# Altium project ArtixDuo.PrjPcb (part 1 of 8)
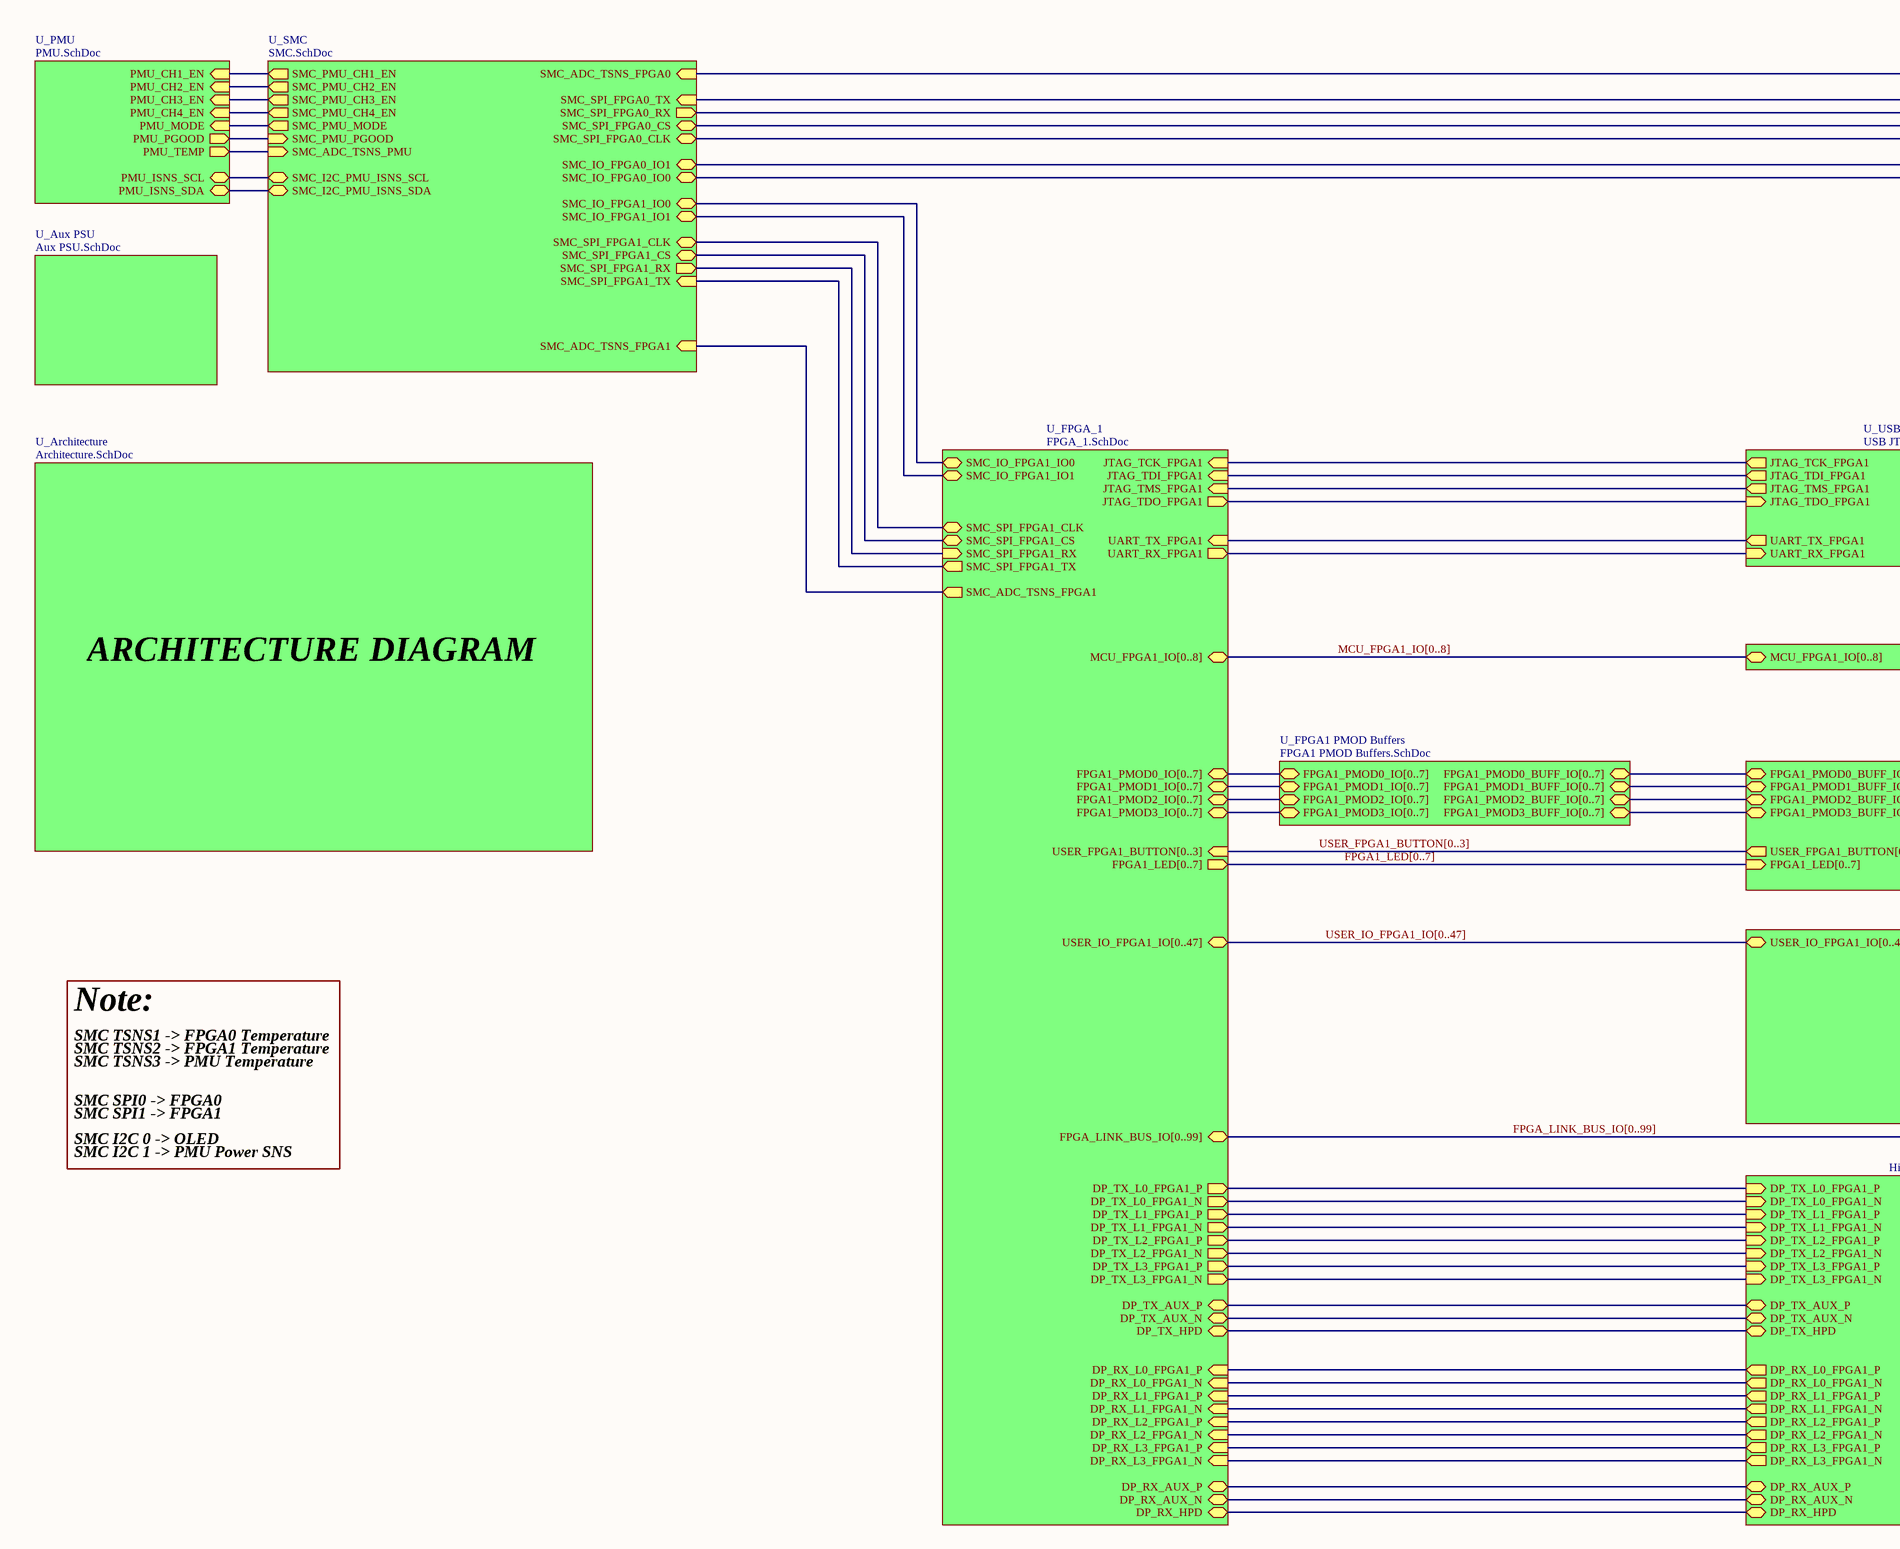
[diagram p0: Top.SchDoc, top left]
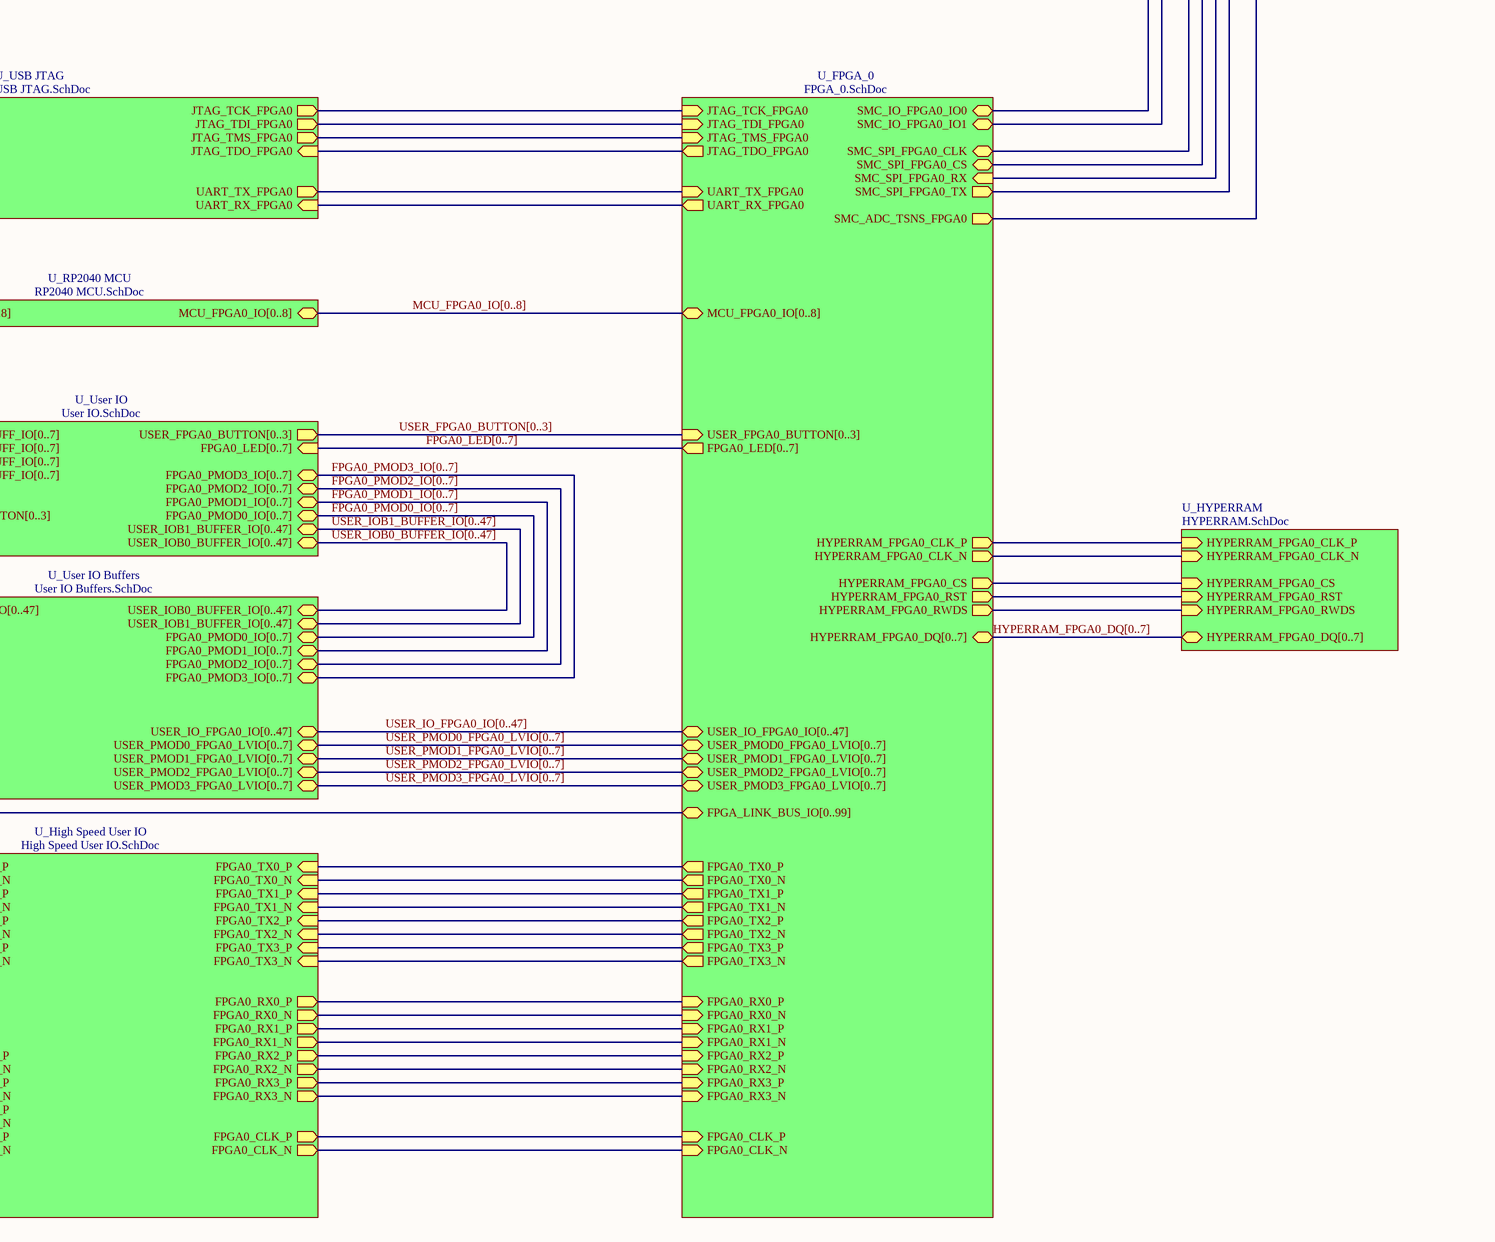
[diagram p1: Top.SchDoc, top right]
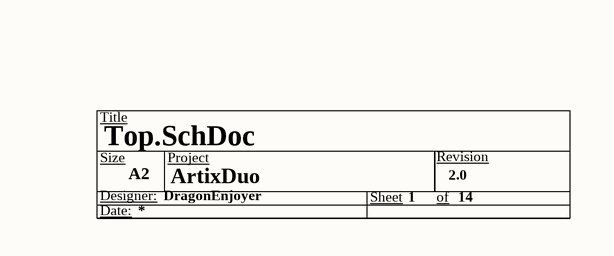
[diagram p2: Top.SchDoc, bottom right]
DesignedByURL: DragonEnjoyer; Project: ArtixDuo; VersionRevision: 2.0
14 sheets, 905 parts. Net scope: hierarchical (ports join the sheet entries above them; power ports are global).
Board file: PCB1.PcbDoc
Sheets:
  Top.SchDoc
    U_Aux PSU = Aux PSU.SchDoc
    U_FPGA_0 = FPGA_0.SchDoc
    U_FPGA_1 = FPGA_1.SchDoc
    U_PMU = PMU.SchDoc
    U_RP2040 MCU = RP2040 MCU.SchDoc
    U_SMC = SMC.SchDoc
    U_USB JTAG = USB JTAG.SchDoc
    U_User IO = User IO.SchDoc
    U_High Speed User IO = High Speed User IO.SchDoc
    U_User IO Buffers = User IO Buffers.SchDoc
    U_HYPERRAM = HYPERRAM.SchDoc
    U_Architecture = Architecture.SchDoc
    U_FPGA1 PMOD Buffers = FPGA1 PMOD Buffers.SchDoc

## Sheet Top.SchDoc
size A1; SheetNumber: 1; SheetTotal: 14

### Parts
(Parts that share a designator on the sheet are numbered #1, #2 ... from top to bottom, then left to right.)
*#1  Size: A2  (hidden comment: Title Block)  (graphical)

### Sub-sheets
U_Architecture = Architecture.SchDoc: no entries
U_Aux PSU = Aux PSU.SchDoc: no entries
U_FPGA1 PMOD Buffers = FPGA1 PMOD Buffers.SchDoc: FPGA1_PMOD0_IO[0..7] (bidir), FPGA1_PMOD1_IO[0..7] (bidir), FPGA1_PMOD2_IO[0..7] (bidir), FPGA1_PMOD3_IO[0..7] (bidir), FPGA1_PMOD1_BUFF_IO[0..7] (bidir), FPGA1_PMOD2_BUFF_IO[0..7] (bidir), FPGA1_PMOD3_BUFF_IO[0..7] (bidir), FPGA1_PMOD0_BUFF_IO[0..7] (bidir)
U_FPGA_0 = FPGA_0.SchDoc: JTAG_TDO_FPGA0 (out), UART_TX_FPGA0 (in), UART_RX_FPGA0 (out), JTAG_TCK_FPGA0 (in), JTAG_TDI_FPGA0 (in), JTAG_TMS_FPGA0 (in), SMC_IO_FPGA0_IO0 (bidir), SMC_IO_FPGA0_IO1 (bidir), MCU_FPGA0_IO[0..8] (bidir), SMC_SPI_FPGA0_RX (in), SMC_SPI_FPGA0_CS (bidir), SMC_SPI_FPGA0_CLK (bidir), SMC_SPI_FPGA0_TX (out), USER_FPGA0_BUTTON[0..3] (in), FPGA0_LED[0..7] (out), FPGA_LINK_BUS_IO[0..99] (bidir), USER_IO_FPGA0_IO[0..47] (bidir), FPGA0_TX0_P (out), FPGA0_TX0_N (out), FPGA0_TX1_P (out), FPGA0_TX1_N (out), FPGA0_TX2_P (out), FPGA0_TX2_N (out), FPGA0_TX3_P (out), FPGA0_TX3_N (out), FPGA0_RX0_P (in), FPGA0_RX0_N (in), FPGA0_RX1_P (in), FPGA0_RX1_N (in), FPGA0_RX2_P (in), FPGA0_RX2_N (in), FPGA0_RX3_P (in), FPGA0_RX3_N (in), FPGA0_CLK_N (in), FPGA0_CLK_P (in), HYPERRAM_FPGA0_CS (out), HYPERRAM_FPGA0_RWDS (out), HYPERRAM_FPGA0_DQ[0..7] (bidir), HYPERRAM_FPGA0_RST (out), USER_PMOD0_FPGA0_LVIO[0..7] (bidir), USER_PMOD1_FPGA0_LVIO[0..7] (bidir), USER_PMOD2_FPGA0_LVIO[0..7] (bidir), USER_PMOD3_FPGA0_LVIO[0..7] (bidir), HYPERRAM_FPGA0_CLK_P (out), HYPERRAM_FPGA0_CLK_N (out), SMC_ADC_TSNS_FPGA0 (out)
U_FPGA_1 = FPGA_1.SchDoc: JTAG_TDO_FPGA1 (out), UART_TX_FPGA1 (in), UART_RX_FPGA1 (out), JTAG_TCK_FPGA1 (in), JTAG_TDI_FPGA1 (in), JTAG_TMS_FPGA1 (in), DP_RX_L3_FPGA1_P (in), DP_RX_L3_FPGA1_N (in), DP_RX_L2_FPGA1_P (in), DP_RX_L2_FPGA1_N (in), DP_RX_L1_FPGA1_P (in), DP_RX_L1_FPGA1_N (in), DP_RX_L0_FPGA1_P (in), DP_RX_L0_FPGA1_N (in), DP_RX_AUX_P (bidir), DP_RX_AUX_N (bidir), DP_RX_HPD (bidir), DP_TX_L3_FPGA1_P (out), DP_TX_L3_FPGA1_N (out), DP_TX_L2_FPGA1_P (out), DP_TX_L2_FPGA1_N (out), DP_TX_L1_FPGA1_P (out), DP_TX_L1_FPGA1_N (out), DP_TX_L0_FPGA1_P (out), DP_TX_L0_FPGA1_N (out), DP_TX_AUX_P (bidir), DP_TX_AUX_N (bidir), DP_TX_HPD (bidir), SMC_IO_FPGA1_IO0 (bidir), SMC_IO_FPGA1_IO1 (bidir), MCU_FPGA1_IO[0..8] (bidir), SMC_SPI_FPGA1_RX (in), SMC_SPI_FPGA1_CS (bidir), SMC_SPI_FPGA1_CLK (bidir), SMC_SPI_FPGA1_TX (out), USER_FPGA1_BUTTON[0..3] (in), FPGA1_LED[0..7] (out), FPGA_LINK_BUS_IO[0..99] (bidir), USER_IO_FPGA1_IO[0..47] (bidir), FPGA1_PMOD0_IO[0..7] (bidir), FPGA1_PMOD1_IO[0..7] (bidir), FPGA1_PMOD2_IO[0..7] (bidir), FPGA1_PMOD3_IO[0..7] (bidir), SMC_ADC_TSNS_FPGA1 (out)
U_High Speed User IO = High Speed User IO.SchDoc: FPGA0_TX0_P (in), FPGA0_TX0_N (in), FPGA0_TX1_P (in), FPGA0_TX1_N (in), FPGA0_TX2_P (in), FPGA0_TX2_N (in), FPGA0_TX3_P (in), FPGA0_TX3_N (in), FPGA0_RX0_P (out), FPGA0_RX0_N (out), FPGA0_RX1_P (out), FPGA0_RX1_N (out), FPGA0_RX2_P (out), FPGA0_RX2_N (out), FPGA0_RX3_P (out), FPGA0_RX3_N (out), FPGA0_CLK_P (out), FPGA0_CLK_N (out), DP_RX_L3_FPGA1_P (out), DP_RX_L3_FPGA1_N (out), DP_RX_L2_FPGA1_P (out), DP_RX_L2_FPGA1_N (out), DP_RX_L1_FPGA1_P (out), DP_RX_L1_FPGA1_N (out), DP_RX_L0_FPGA1_P (out), DP_RX_L0_FPGA1_N (out), DP_RX_AUX_P (bidir), DP_RX_AUX_N (bidir), DP_RX_HPD (bidir), DP_TX_L3_FPGA1_P (in), DP_TX_L3_FPGA1_N (in), DP_TX_L2_FPGA1_P (in), DP_TX_L2_FPGA1_N (in), DP_TX_L1_FPGA1_P (in), DP_TX_L1_FPGA1_N (in), DP_TX_L0_FPGA1_P (in), DP_TX_L0_FPGA1_N (in), DP_TX_AUX_P (bidir), DP_TX_AUX_N (bidir), DP_TX_HPD (bidir)
U_HYPERRAM = HYPERRAM.SchDoc: HYPERRAM_FPGA0_CLK_P (in), HYPERRAM_FPGA0_CLK_N (in), HYPERRAM_FPGA0_CS (in), HYPERRAM_FPGA0_RST (in), HYPERRAM_FPGA0_RWDS (in), HYPERRAM_FPGA0_DQ[0..7] (bidir)
U_PMU = PMU.SchDoc: PMU_MODE (in), PMU_TEMP (out), PMU_PGOOD (out), PMU_CH1_EN (in), PMU_CH2_EN (in), PMU_CH3_EN (in), PMU_CH4_EN (in), PMU_ISNS_SCL (bidir), PMU_ISNS_SDA (bidir)
U_RP2040 MCU = RP2040 MCU.SchDoc: MCU_FPGA1_IO[0..8] (bidir), MCU_FPGA0_IO[0..8] (bidir)
U_SMC = SMC.SchDoc: SMC_I2C_PMU_ISNS_SDA (bidir), SMC_I2C_PMU_ISNS_SCL (bidir), SMC_PMU_MODE (out), SMC_PMU_CH1_EN (out), SMC_PMU_CH2_EN (out), SMC_PMU_CH3_EN (out), SMC_PMU_CH4_EN (out), SMC_PMU_PGOOD (in), SMC_SPI_FPGA1_RX (out), SMC_SPI_FPGA1_CS (bidir), SMC_SPI_FPGA1_CLK (bidir), SMC_SPI_FPGA1_TX (in), SMC_SPI_FPGA0_RX (out), SMC_SPI_FPGA0_CS (bidir), SMC_SPI_FPGA0_CLK (bidir), SMC_SPI_FPGA0_TX (in), SMC_IO_FPGA1_IO0 (bidir), SMC_IO_FPGA1_IO1 (bidir), SMC_IO_FPGA0_IO0 (bidir), SMC_IO_FPGA0_IO1 (bidir), SMC_ADC_TSNS_PMU (in), SMC_ADC_TSNS_FPGA1 (in), SMC_ADC_TSNS_FPGA0 (in)
U_USB JTAG = USB JTAG.SchDoc: JTAG_TCK_FPGA0 (out), JTAG_TDI_FPGA0 (out), JTAG_TMS_FPGA0 (out), JTAG_TDO_FPGA0 (in), JTAG_TDO_FPGA1 (in), UART_TX_FPGA0 (out), UART_RX_FPGA0 (in), UART_TX_FPGA1 (out), UART_RX_FPGA1 (in), JTAG_TCK_FPGA1 (out), JTAG_TDI_FPGA1 (out), JTAG_TMS_FPGA1 (out)
U_User IO = User IO.SchDoc: FPGA0_PMOD0_IO[0..7] (bidir), FPGA0_PMOD1_IO[0..7] (bidir), FPGA0_PMOD2_IO[0..7] (bidir), FPGA0_PMOD3_IO[0..7] (bidir), FPGA1_PMOD0_BUFF_IO[0..7] (bidir), FPGA1_PMOD1_BUFF_IO[0..7] (bidir), FPGA1_PMOD2_BUFF_IO[0..7] (bidir), FPGA1_PMOD3_BUFF_IO[0..7] (bidir), USER_FPGA0_BUTTON[0..3] (out), USER_FPGA1_BUTTON[0..3] (out), FPGA0_LED[0..7] (in), FPGA1_LED[0..7] (in), USER_IOB0_BUFFER_IO[0..47] (bidir), USER_IOB1_BUFFER_IO[0..47] (bidir)
U_User IO Buffers = User IO Buffers.SchDoc: USER_IO_FPGA1_IO[0..47] (bidir), USER_IOB1_BUFFER_IO[0..47] (bidir), USER_IO_FPGA0_IO[0..47] (bidir), USER_IOB0_BUFFER_IO[0..47] (bidir), FPGA0_PMOD0_IO[0..7] (bidir), USER_PMOD0_FPGA0_LVIO[0..7] (bidir), FPGA0_PMOD1_IO[0..7] (bidir), USER_PMOD1_FPGA0_LVIO[0..7] (bidir), FPGA0_PMOD2_IO[0..7] (bidir), USER_PMOD2_FPGA0_LVIO[0..7] (bidir), FPGA0_PMOD3_IO[0..7] (bidir), USER_PMOD3_FPGA0_LVIO[0..7] (bidir)

### Nets
DP_RX_AUX_N: sheet U_FPGA_1/DP_RX_AUX_N, sheet U_High Speed User IO/DP_RX_AUX_N
DP_RX_AUX_P: sheet U_FPGA_1/DP_RX_AUX_P, sheet U_High Speed User IO/DP_RX_AUX_P
DP_RX_HPD: sheet U_FPGA_1/DP_RX_HPD, sheet U_High Speed User IO/DP_RX_HPD
DP_RX_L0_FPGA1_N: sheet U_FPGA_1/DP_RX_L0_FPGA1_N, sheet U_High Speed User IO/DP_RX_L0_FPGA1_N
DP_RX_L0_FPGA1_P: sheet U_FPGA_1/DP_RX_L0_FPGA1_P, sheet U_High Speed User IO/DP_RX_L0_FPGA1_P
DP_RX_L1_FPGA1_N: sheet U_FPGA_1/DP_RX_L1_FPGA1_N, sheet U_High Speed User IO/DP_RX_L1_FPGA1_N
DP_RX_L1_FPGA1_P: sheet U_FPGA_1/DP_RX_L1_FPGA1_P, sheet U_High Speed User IO/DP_RX_L1_FPGA1_P
DP_RX_L2_FPGA1_N: sheet U_FPGA_1/DP_RX_L2_FPGA1_N, sheet U_High Speed User IO/DP_RX_L2_FPGA1_N
DP_RX_L2_FPGA1_P: sheet U_FPGA_1/DP_RX_L2_FPGA1_P, sheet U_High Speed User IO/DP_RX_L2_FPGA1_P
DP_RX_L3_FPGA1_N: sheet U_FPGA_1/DP_RX_L3_FPGA1_N, sheet U_High Speed User IO/DP_RX_L3_FPGA1_N
DP_RX_L3_FPGA1_P: sheet U_FPGA_1/DP_RX_L3_FPGA1_P, sheet U_High Speed User IO/DP_RX_L3_FPGA1_P
DP_TX_AUX_N: sheet U_FPGA_1/DP_TX_AUX_N, sheet U_High Speed User IO/DP_TX_AUX_N
DP_TX_AUX_P: sheet U_FPGA_1/DP_TX_AUX_P, sheet U_High Speed User IO/DP_TX_AUX_P
DP_TX_HPD: sheet U_FPGA_1/DP_TX_HPD, sheet U_High Speed User IO/DP_TX_HPD
DP_TX_L0_FPGA1_N: sheet U_FPGA_1/DP_TX_L0_FPGA1_N, sheet U_High Speed User IO/DP_TX_L0_FPGA1_N
DP_TX_L0_FPGA1_P: sheet U_FPGA_1/DP_TX_L0_FPGA1_P, sheet U_High Speed User IO/DP_TX_L0_FPGA1_P
DP_TX_L1_FPGA1_N: sheet U_FPGA_1/DP_TX_L1_FPGA1_N, sheet U_High Speed User IO/DP_TX_L1_FPGA1_N
DP_TX_L1_FPGA1_P: sheet U_FPGA_1/DP_TX_L1_FPGA1_P, sheet U_High Speed User IO/DP_TX_L1_FPGA1_P
DP_TX_L2_FPGA1_N: sheet U_FPGA_1/DP_TX_L2_FPGA1_N, sheet U_High Speed User IO/DP_TX_L2_FPGA1_N
DP_TX_L2_FPGA1_P: sheet U_FPGA_1/DP_TX_L2_FPGA1_P, sheet U_High Speed User IO/DP_TX_L2_FPGA1_P
DP_TX_L3_FPGA1_N: sheet U_FPGA_1/DP_TX_L3_FPGA1_N, sheet U_High Speed User IO/DP_TX_L3_FPGA1_N
DP_TX_L3_FPGA1_P: sheet U_FPGA_1/DP_TX_L3_FPGA1_P, sheet U_High Speed User IO/DP_TX_L3_FPGA1_P
FPGA0_CLK_N: sheet U_FPGA_0/FPGA0_CLK_N, sheet U_High Speed User IO/FPGA0_CLK_N
FPGA0_CLK_P: sheet U_FPGA_0/FPGA0_CLK_P, sheet U_High Speed User IO/FPGA0_CLK_P
FPGA0_RX0_N: sheet U_FPGA_0/FPGA0_RX0_N, sheet U_High Speed User IO/FPGA0_RX0_N
FPGA0_RX0_P: sheet U_FPGA_0/FPGA0_RX0_P, sheet U_High Speed User IO/FPGA0_RX0_P
FPGA0_RX1_N: sheet U_FPGA_0/FPGA0_RX1_N, sheet U_High Speed User IO/FPGA0_RX1_N
FPGA0_RX1_P: sheet U_FPGA_0/FPGA0_RX1_P, sheet U_High Speed User IO/FPGA0_RX1_P
FPGA0_RX2_N: sheet U_FPGA_0/FPGA0_RX2_N, sheet U_High Speed User IO/FPGA0_RX2_N
FPGA0_RX2_P: sheet U_FPGA_0/FPGA0_RX2_P, sheet U_High Speed User IO/FPGA0_RX2_P
FPGA0_RX3_N: sheet U_FPGA_0/FPGA0_RX3_N, sheet U_High Speed User IO/FPGA0_RX3_N
FPGA0_RX3_P: sheet U_FPGA_0/FPGA0_RX3_P, sheet U_High Speed User IO/FPGA0_RX3_P
FPGA0_TX0_N: sheet U_FPGA_0/FPGA0_TX0_N, sheet U_High Speed User IO/FPGA0_TX0_N
FPGA0_TX0_P: sheet U_FPGA_0/FPGA0_TX0_P, sheet U_High Speed User IO/FPGA0_TX0_P
FPGA0_TX1_N: sheet U_FPGA_0/FPGA0_TX1_N, sheet U_High Speed User IO/FPGA0_TX1_N
FPGA0_TX1_P: sheet U_FPGA_0/FPGA0_TX1_P, sheet U_High Speed User IO/FPGA0_TX1_P
FPGA0_TX2_N: sheet U_FPGA_0/FPGA0_TX2_N, sheet U_High Speed User IO/FPGA0_TX2_N
FPGA0_TX2_P: sheet U_FPGA_0/FPGA0_TX2_P, sheet U_High Speed User IO/FPGA0_TX2_P
FPGA0_TX3_N: sheet U_FPGA_0/FPGA0_TX3_N, sheet U_High Speed User IO/FPGA0_TX3_N
FPGA0_TX3_P: sheet U_FPGA_0/FPGA0_TX3_P, sheet U_High Speed User IO/FPGA0_TX3_P
HYPERRAM_FPGA0_CLK_N: sheet U_FPGA_0/HYPERRAM_FPGA0_CLK_N, sheet U_HYPERRAM/HYPERRAM_FPGA0_CLK_N
HYPERRAM_FPGA0_CLK_P: sheet U_FPGA_0/HYPERRAM_FPGA0_CLK_P, sheet U_HYPERRAM/HYPERRAM_FPGA0_CLK_P
HYPERRAM_FPGA0_CS: sheet U_FPGA_0/HYPERRAM_FPGA0_CS, sheet U_HYPERRAM/HYPERRAM_FPGA0_CS
HYPERRAM_FPGA0_RST: sheet U_FPGA_0/HYPERRAM_FPGA0_RST, sheet U_HYPERRAM/HYPERRAM_FPGA0_RST
HYPERRAM_FPGA0_RWDS: sheet U_FPGA_0/HYPERRAM_FPGA0_RWDS, sheet U_HYPERRAM/HYPERRAM_FPGA0_RWDS
JTAG_TCK_FPGA0: sheet U_FPGA_0/JTAG_TCK_FPGA0, sheet U_USB JTAG/JTAG_TCK_FPGA0
JTAG_TCK_FPGA1: sheet U_FPGA_1/JTAG_TCK_FPGA1, sheet U_USB JTAG/JTAG_TCK_FPGA1
JTAG_TDI_FPGA0: sheet U_FPGA_0/JTAG_TDI_FPGA0, sheet U_USB JTAG/JTAG_TDI_FPGA0
JTAG_TDI_FPGA1: sheet U_FPGA_1/JTAG_TDI_FPGA1, sheet U_USB JTAG/JTAG_TDI_FPGA1
JTAG_TDO_FPGA0: sheet U_FPGA_0/JTAG_TDO_FPGA0, sheet U_USB JTAG/JTAG_TDO_FPGA0
JTAG_TDO_FPGA1: sheet U_FPGA_1/JTAG_TDO_FPGA1, sheet U_USB JTAG/JTAG_TDO_FPGA1
JTAG_TMS_FPGA0: sheet U_FPGA_0/JTAG_TMS_FPGA0, sheet U_USB JTAG/JTAG_TMS_FPGA0
JTAG_TMS_FPGA1: sheet U_FPGA_1/JTAG_TMS_FPGA1, sheet U_USB JTAG/JTAG_TMS_FPGA1
PMU_CH1_EN: sheet U_PMU/PMU_CH1_EN, sheet U_SMC/SMC_PMU_CH1_EN
PMU_CH2_EN: sheet U_PMU/PMU_CH2_EN, sheet U_SMC/SMC_PMU_CH2_EN
PMU_CH3_EN: sheet U_PMU/PMU_CH3_EN, sheet U_SMC/SMC_PMU_CH3_EN
PMU_CH4_EN: sheet U_PMU/PMU_CH4_EN, sheet U_SMC/SMC_PMU_CH4_EN
PMU_ISNS_SCL: sheet U_PMU/PMU_ISNS_SCL, sheet U_SMC/SMC_I2C_PMU_ISNS_SCL
PMU_ISNS_SDA: sheet U_PMU/PMU_ISNS_SDA, sheet U_SMC/SMC_I2C_PMU_ISNS_SDA
PMU_MODE: sheet U_PMU/PMU_MODE, sheet U_SMC/SMC_PMU_MODE
PMU_PGOOD: sheet U_PMU/PMU_PGOOD, sheet U_SMC/SMC_PMU_PGOOD
PMU_TEMP: sheet U_PMU/PMU_TEMP, sheet U_SMC/SMC_ADC_TSNS_PMU
SMC_ADC_TSNS_FPGA0: sheet U_FPGA_0/SMC_ADC_TSNS_FPGA0, sheet U_SMC/SMC_ADC_TSNS_FPGA0
SMC_ADC_TSNS_FPGA1: sheet U_FPGA_1/SMC_ADC_TSNS_FPGA1, sheet U_SMC/SMC_ADC_TSNS_FPGA1
SMC_IO_FPGA0_IO0: sheet U_FPGA_0/SMC_IO_FPGA0_IO0, sheet U_SMC/SMC_IO_FPGA0_IO0
SMC_IO_FPGA0_IO1: sheet U_FPGA_0/SMC_IO_FPGA0_IO1, sheet U_SMC/SMC_IO_FPGA0_IO1
SMC_IO_FPGA1_IO0: sheet U_FPGA_1/SMC_IO_FPGA1_IO0, sheet U_SMC/SMC_IO_FPGA1_IO0
SMC_IO_FPGA1_IO1: sheet U_FPGA_1/SMC_IO_FPGA1_IO1, sheet U_SMC/SMC_IO_FPGA1_IO1
SMC_SPI_FPGA0_CLK: sheet U_FPGA_0/SMC_SPI_FPGA0_CLK, sheet U_SMC/SMC_SPI_FPGA0_CLK
SMC_SPI_FPGA0_CS: sheet U_FPGA_0/SMC_SPI_FPGA0_CS, sheet U_SMC/SMC_SPI_FPGA0_CS
SMC_SPI_FPGA0_RX: sheet U_FPGA_0/SMC_SPI_FPGA0_RX, sheet U_SMC/SMC_SPI_FPGA0_RX
SMC_SPI_FPGA0_TX: sheet U_FPGA_0/SMC_SPI_FPGA0_TX, sheet U_SMC/SMC_SPI_FPGA0_TX
SMC_SPI_FPGA1_CLK: sheet U_FPGA_1/SMC_SPI_FPGA1_CLK, sheet U_SMC/SMC_SPI_FPGA1_CLK
SMC_SPI_FPGA1_CS: sheet U_FPGA_1/SMC_SPI_FPGA1_CS, sheet U_SMC/SMC_SPI_FPGA1_CS
SMC_SPI_FPGA1_RX: sheet U_FPGA_1/SMC_SPI_FPGA1_RX, sheet U_SMC/SMC_SPI_FPGA1_RX
SMC_SPI_FPGA1_TX: sheet U_FPGA_1/SMC_SPI_FPGA1_TX, sheet U_SMC/SMC_SPI_FPGA1_TX
UART_RX_FPGA0: sheet U_FPGA_0/UART_RX_FPGA0, sheet U_USB JTAG/UART_RX_FPGA0
UART_RX_FPGA1: sheet U_FPGA_1/UART_RX_FPGA1, sheet U_USB JTAG/UART_RX_FPGA1
UART_TX_FPGA0: sheet U_FPGA_0/UART_TX_FPGA0, sheet U_USB JTAG/UART_TX_FPGA0
UART_TX_FPGA1: sheet U_FPGA_1/UART_TX_FPGA1, sheet U_USB JTAG/UART_TX_FPGA1

### Buses and harness runs
bus FPGA0_LED[0..7] = sheet U_FPGA_0/FPGA0_LED[0..7] = sheet U_User IO/FPGA0_LED[0..7]
bus FPGA0_PMOD0_IO[0..7] = sheet U_User IO Buffers/FPGA0_PMOD0_IO[0..7] = sheet U_User IO/FPGA0_PMOD0_IO[0..7]
bus FPGA0_PMOD1_IO[0..7] = sheet U_User IO Buffers/FPGA0_PMOD1_IO[0..7] = sheet U_User IO/FPGA0_PMOD1_IO[0..7]
bus FPGA0_PMOD2_IO[0..7] = sheet U_User IO Buffers/FPGA0_PMOD2_IO[0..7] = sheet U_User IO/FPGA0_PMOD2_IO[0..7]
bus FPGA0_PMOD3_IO[0..7] = sheet U_User IO Buffers/FPGA0_PMOD3_IO[0..7] = sheet U_User IO/FPGA0_PMOD3_IO[0..7]
bus FPGA1_LED[0..7] = sheet U_FPGA_1/FPGA1_LED[0..7] = sheet U_User IO/FPGA1_LED[0..7]
bus FPGA_LINK_BUS_IO[0..99] = sheet U_FPGA_0/FPGA_LINK_BUS_IO[0..99] = sheet U_FPGA_1/FPGA_LINK_BUS_IO[0..99]
bus HYPERRAM_FPGA0_DQ[0..7] = sheet U_FPGA_0/HYPERRAM_FPGA0_DQ[0..7] = sheet U_HYPERRAM/HYPERRAM_FPGA0_DQ[0..7]
bus MCU_FPGA0_IO[0..8] = sheet U_FPGA_0/MCU_FPGA0_IO[0..8] = sheet U_RP2040 MCU/MCU_FPGA0_IO[0..8]
bus MCU_FPGA1_IO[0..8] = sheet U_FPGA_1/MCU_FPGA1_IO[0..8] = sheet U_RP2040 MCU/MCU_FPGA1_IO[0..8]
bus sheet U_FPGA1 PMOD Buffers/FPGA1_PMOD0_BUFF_IO[0..7] = sheet U_User IO/FPGA1_PMOD0_BUFF_IO[0..7]
bus sheet U_FPGA1 PMOD Buffers/FPGA1_PMOD0_IO[0..7] = sheet U_FPGA_1/FPGA1_PMOD0_IO[0..7]
bus sheet U_FPGA1 PMOD Buffers/FPGA1_PMOD1_BUFF_IO[0..7] = sheet U_User IO/FPGA1_PMOD1_BUFF_IO[0..7]
bus sheet U_FPGA1 PMOD Buffers/FPGA1_PMOD1_IO[0..7] = sheet U_FPGA_1/FPGA1_PMOD1_IO[0..7]
bus sheet U_FPGA1 PMOD Buffers/FPGA1_PMOD2_BUFF_IO[0..7] = sheet U_User IO/FPGA1_PMOD2_BUFF_IO[0..7]
bus sheet U_FPGA1 PMOD Buffers/FPGA1_PMOD2_IO[0..7] = sheet U_FPGA_1/FPGA1_PMOD2_IO[0..7]
bus sheet U_FPGA1 PMOD Buffers/FPGA1_PMOD3_BUFF_IO[0..7] = sheet U_User IO/FPGA1_PMOD3_BUFF_IO[0..7]
bus sheet U_FPGA1 PMOD Buffers/FPGA1_PMOD3_IO[0..7] = sheet U_FPGA_1/FPGA1_PMOD3_IO[0..7]
bus USER_FPGA0_BUTTON[0..3] = sheet U_FPGA_0/USER_FPGA0_BUTTON[0..3] = sheet U_User IO/USER_FPGA0_BUTTON[0..3]
bus USER_FPGA1_BUTTON[0..3] = sheet U_FPGA_1/USER_FPGA1_BUTTON[0..3] = sheet U_User IO/USER_FPGA1_BUTTON[0..3]
bus USER_IO_FPGA0_IO[0..47] = sheet U_FPGA_0/USER_IO_FPGA0_IO[0..47] = sheet U_User IO Buffers/USER_IO_FPGA0_IO[0..47]
bus USER_IO_FPGA1_IO[0..47] = sheet U_FPGA_1/USER_IO_FPGA1_IO[0..47] = sheet U_User IO Buffers/USER_IO_FPGA1_IO[0..47]
bus USER_IOB0_BUFFER_IO[0..47] = sheet U_User IO Buffers/USER_IOB0_BUFFER_IO[0..47] = sheet U_User IO/USER_IOB0_BUFFER_IO[0..47]
bus USER_IOB1_BUFFER_IO[0..47] = sheet U_User IO Buffers/USER_IOB1_BUFFER_IO[0..47] = sheet U_User IO/USER_IOB1_BUFFER_IO[0..47]
bus USER_PMOD0_FPGA0_LVIO[0..7] = sheet U_FPGA_0/USER_PMOD0_FPGA0_LVIO[0..7] = sheet U_User IO Buffers/USER_PMOD0_FPGA0_LVIO[0..7]
bus USER_PMOD1_FPGA0_LVIO[0..7] = sheet U_FPGA_0/USER_PMOD1_FPGA0_LVIO[0..7] = sheet U_User IO Buffers/USER_PMOD1_FPGA0_LVIO[0..7]
bus USER_PMOD2_FPGA0_LVIO[0..7] = sheet U_FPGA_0/USER_PMOD2_FPGA0_LVIO[0..7] = sheet U_User IO Buffers/USER_PMOD2_FPGA0_LVIO[0..7]
bus USER_PMOD3_FPGA0_LVIO[0..7] = sheet U_FPGA_0/USER_PMOD3_FPGA0_LVIO[0..7] = sheet U_User IO Buffers/USER_PMOD3_FPGA0_LVIO[0..7]

### Notes on the sheet
- ARCHITECTURE DIAGRAM
- Note:
- SMC TSNS1 -> FPGA0 Temperature
- SMC TSNS2 -> FPGA1 Temperature
- SMC TSNS3 -> PMU Temperature
- SMC SPI0 -> FPGA0
- SMC SPI1 -> FPGA1
- SMC I2C 0 -> OLED
- SMC I2C 1 -> PMU Power SNS
- (in symbol CMP-007-000006-8) Title; Size; Project; Revision; Designer:; Sheet; of; Date:

### Library data of the parts
*#1 = CMP-007-000006-8: Generic Title Block

## Sheet Aux PSU.SchDoc
size A4; SheetNumber: 9; SheetTotal: 12
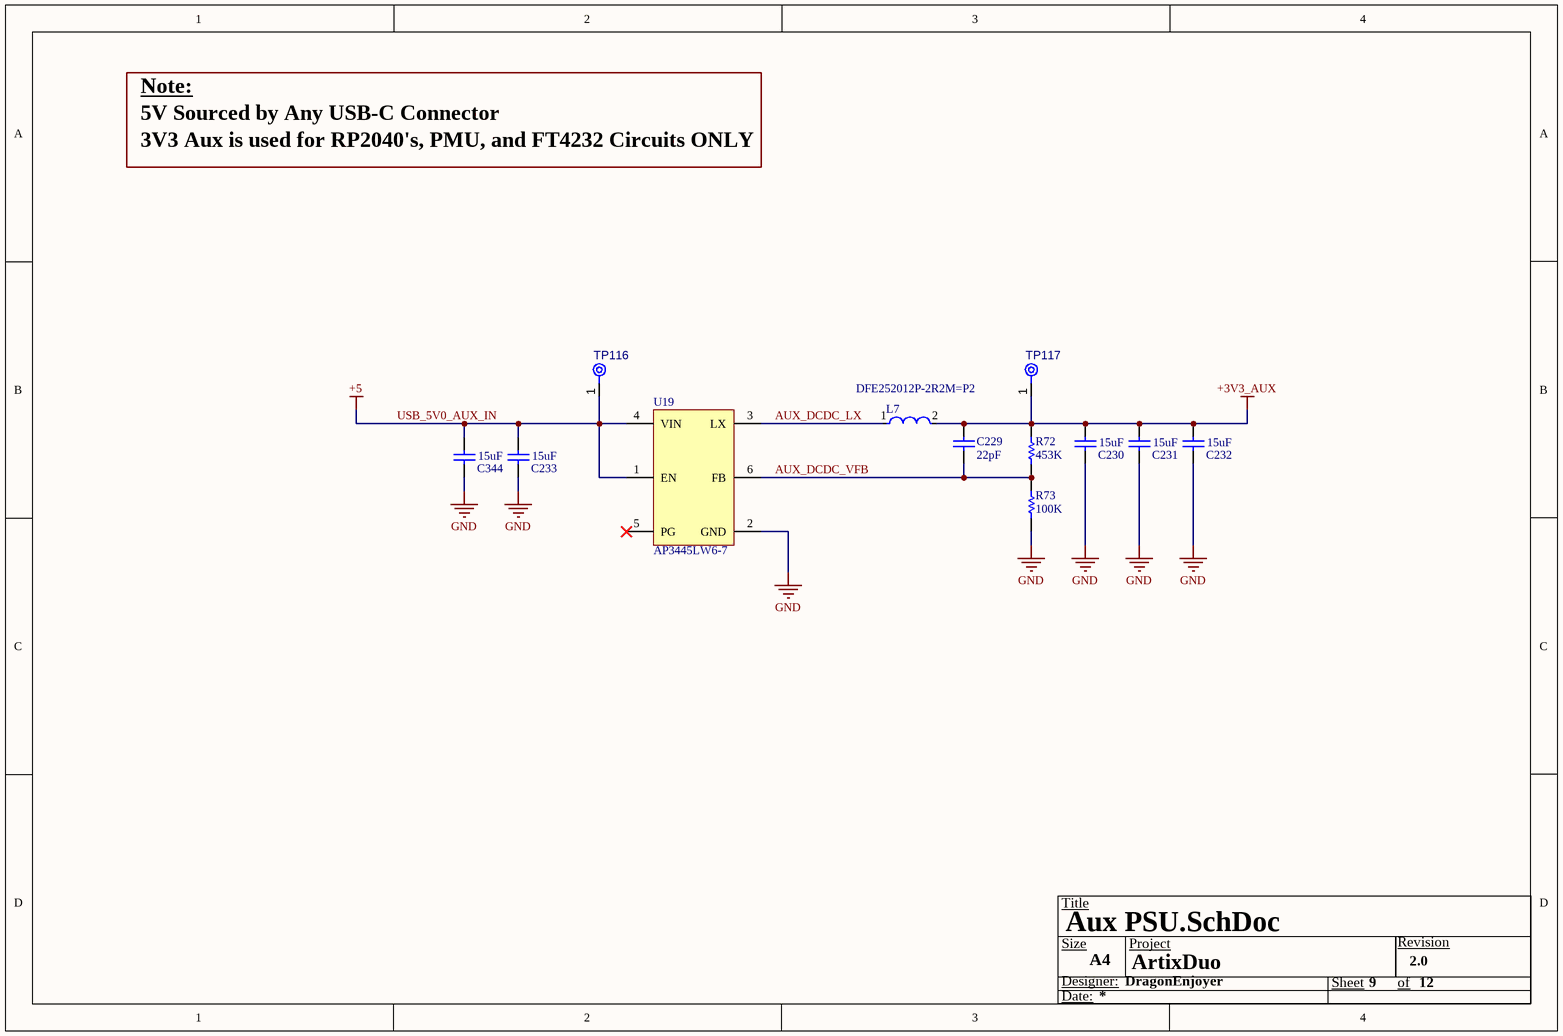
[diagram p3: Aux PSU.SchDoc]

### Parts
(Parts that share a designator on the sheet are numbered #1, #2 ... from top to bottom, then left to right.)
*#2  Size: A4  (hidden comment: Title Block)  (graphical)
C229  22pF  [CAPC1005X55X25ML05T05]
C230  15uF  [CAPC0805(2012)145_L]
C231  15uF  [CAPC0805(2012)145_L]
C232  15uF  [CAPC0805(2012)145_L]
C233  15uF  [CAPC0805(2012)145_L]
C344  15uF  [CAPC0805(2012)145_L]
L7  DFE252012P-2R2M=P2  [FP-DFE252012C-MFG]
R72  453K  [RESC1005X40X25NL05T10]
R73  100K  [RESC1005X40X25NL05T10]
TP116  TPAD6R  [TP06R]  (value not drawn)  (no BOM)
TP117  TPAD6R  [TP06R]  (value not drawn)  (no BOM)
U19  AP3445LW6-7  [SOT95P245X130-6N]

### Nets
+3V3_AUX: C229.2 C230.2 C231.2 C232.2 L7.2 R72.2 TP117.1(TP)
GND: C230.1 C231.1 C232.1 C233.1 C344.1 R73.1 U19.2(GND)
USB_5V0_AUX_IN: C233.2 C344.2 TP116.1(TP) U19.1(EN) U19.4(VIN)  [also labelled +5]
AUX_DCDC_LX: L7.1 U19.3(LX)
AUX_DCDC_VFB: C229.1 R72.1 R73.2 U19.6(FB)

Not connected (* = marked no-connect by the designer): U19 5(PG)*

### Notes on the sheet
- Note:
- 5V Sourced by Any USB-C Connector
- 3V3 Aux is used for RP2040's, PMU, and FT4232 Circuits ONLY
- (in symbol CMP-007-000006-8) Title; Size; Project; Revision; Designer:; Sheet; of; Date:

### Library data of the parts
*#2 = CMP-007-000006-8: Generic Title Block
C229 = CMP-2100-03590-1: Chip Capacitor, 22 pF, +/- 5%, 50 V, -55 to 125 degC, 0402 (1005 Metric), RoHS, Tape and Reel CC0402JRNPO9BN220; Manufacturer: Yageo; Voltage Rating: 50V; Dielectric Material: Ceramic; Temperature Coefficient: 30ppm/degC; Dielectric: C0G; Insulation Resistance: 100GR; Datasheet URL: http://www.yageo.com/NewPortal/yageodocoutput?fileName=/pdf/MLCC/UPY-GP_NP0_16V-to-50V_14.pdf; Depth: 0.5mm; Number of Pins: 2; Height: 0.5mm; Min Operating Temperature: -55degC; REACH SVHC: NoSVHC; Capacitance: 22pF; Max Operating Temperature: 125degC; Voltage Rating (DC): 50V; Composition: Ceramic; Packaging: TapeandReel; Package Quantity: 1; Package Reference: 0402; Length: 1mm; Radiation Hardening: No; Package Description: 2-Pin Surface Mount Device, Body 1 x 0.5 mm; RoHSCompliant: True; Thickness: 0.022inch; Manufacturer URL: http://www.yageo.com/; Mount: SurfaceMount; Case Code (Metric): 1005; Case/Package: 0402; Tolerance: 5%; Termination: SMD/SMT; Width: 0.02inch; Datasheet Version: Rev. 14, 07/2016; Lead Free: LeadFree; Case Code (Imperial): 0402
C230-C233 C344 = CMP-001-00092-1: C Series 0805 15 uF 35 V ±20 % Tolerance X5R SMT Multilayer Ceramic Capacitor C2012X5R1V156M125AC
L7 = CMP-06042-014522-1: Shielded Wirewound Inductor 2.2uH 20% 2200mA 0.084Ω 1008 (2520); Max DC Current: 2.2A; Current Rating: 3A; Core Material: Ferrite; Test Frequency: 1MHz; DC Resistance (DCR): 84mR; Case/Package: 1008; Case Code (Metric): 2520; Resistor Type: Wirewound; Lead Free: Lead Free; Shielding: Shielded; Depth: 2mm; Case Code (Imperial): 1008; Packaging: Tape and Reel; Width: 0.079inch; Min Operating Temperature: -40°C; Height - Seated (Max): 0.039inch; Tolerance: 20%; Max Operating Temperature: 125°C; Mount: Surface Mount; Length: 0.098inch; Inductance: 2.2uH
R72 = CMP-2002-07690-1: RC0402FR-07453KL; Manufacturer: Yageo; Part Number: RC0402FR-07453KL
R73 = CMP-2002-07343-1: RC0402FR-07100KL; Manufacturer: Yageo / Phycomp; Part Number: RC0402FR-07100KL
TP116 TP117 = CMP-00028-00002-1: 0.6mm round; Pins: 1
U19 = CMP-019-00072-1: AP3445 Series 5.5 V 2 A 588 mW Surface Mount Buck Switching Regulator - SOT-23-6